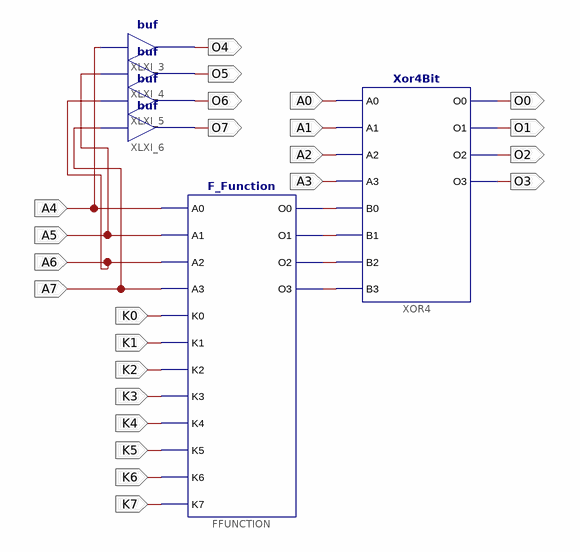
[diagram p0: schematic sheet 1]
// Xilinx ISE schematic round.sch (xc9500xl) as structural Verilog: 6 symbols, 24 ports
module round (
  input  A0,
  input  A1,
  input  A2,
  input  A3,
  input  A4,
  input  A5,
  input  A6,
  input  A7,
  input  K0,
  input  K1,
  input  K2,
  input  K3,
  input  K4,
  input  K5,
  input  K6,
  input  K7,
  output O0,
  output O1,
  output O2,
  output O3,
  output O4,
  output O5,
  output O6,
  output O7
);

  wire XLXN_1, XLXN_2, XLXN_3, XLXN_4;

  Xor4Bit XOR4 (
    .A0(A0), .A1(A1), .A2(A2), .A3(A3), .B0(XLXN_1), .B1(XLXN_2), .B2(XLXN_3), .B3(XLXN_4), .O0(O0), .O1(O1),
    .O2(O2), .O3(O3));
  buf XLXI_3 (O4, A4);
  buf XLXI_4 (O5, A5);
  buf XLXI_5 (O6, A6);
  buf XLXI_6 (O7, A7);
  F_Function FFUNCTION (
    .A0(A4), .A1(A5), .A2(A6), .A3(A7), .K0(K0), .K1(K1), .K2(K2), .K3(K3), .K4(K4), .K5(K5), .K6(K6),
    .K7(K7), .O0(XLXN_1), .O1(XLXN_2), .O2(XLXN_3), .O3(XLXN_4));
endmodule
